# Altium schematic sheet 0263_GPU VCCGT IMVP8 VR.SchDoc
size 848 x 558 mm
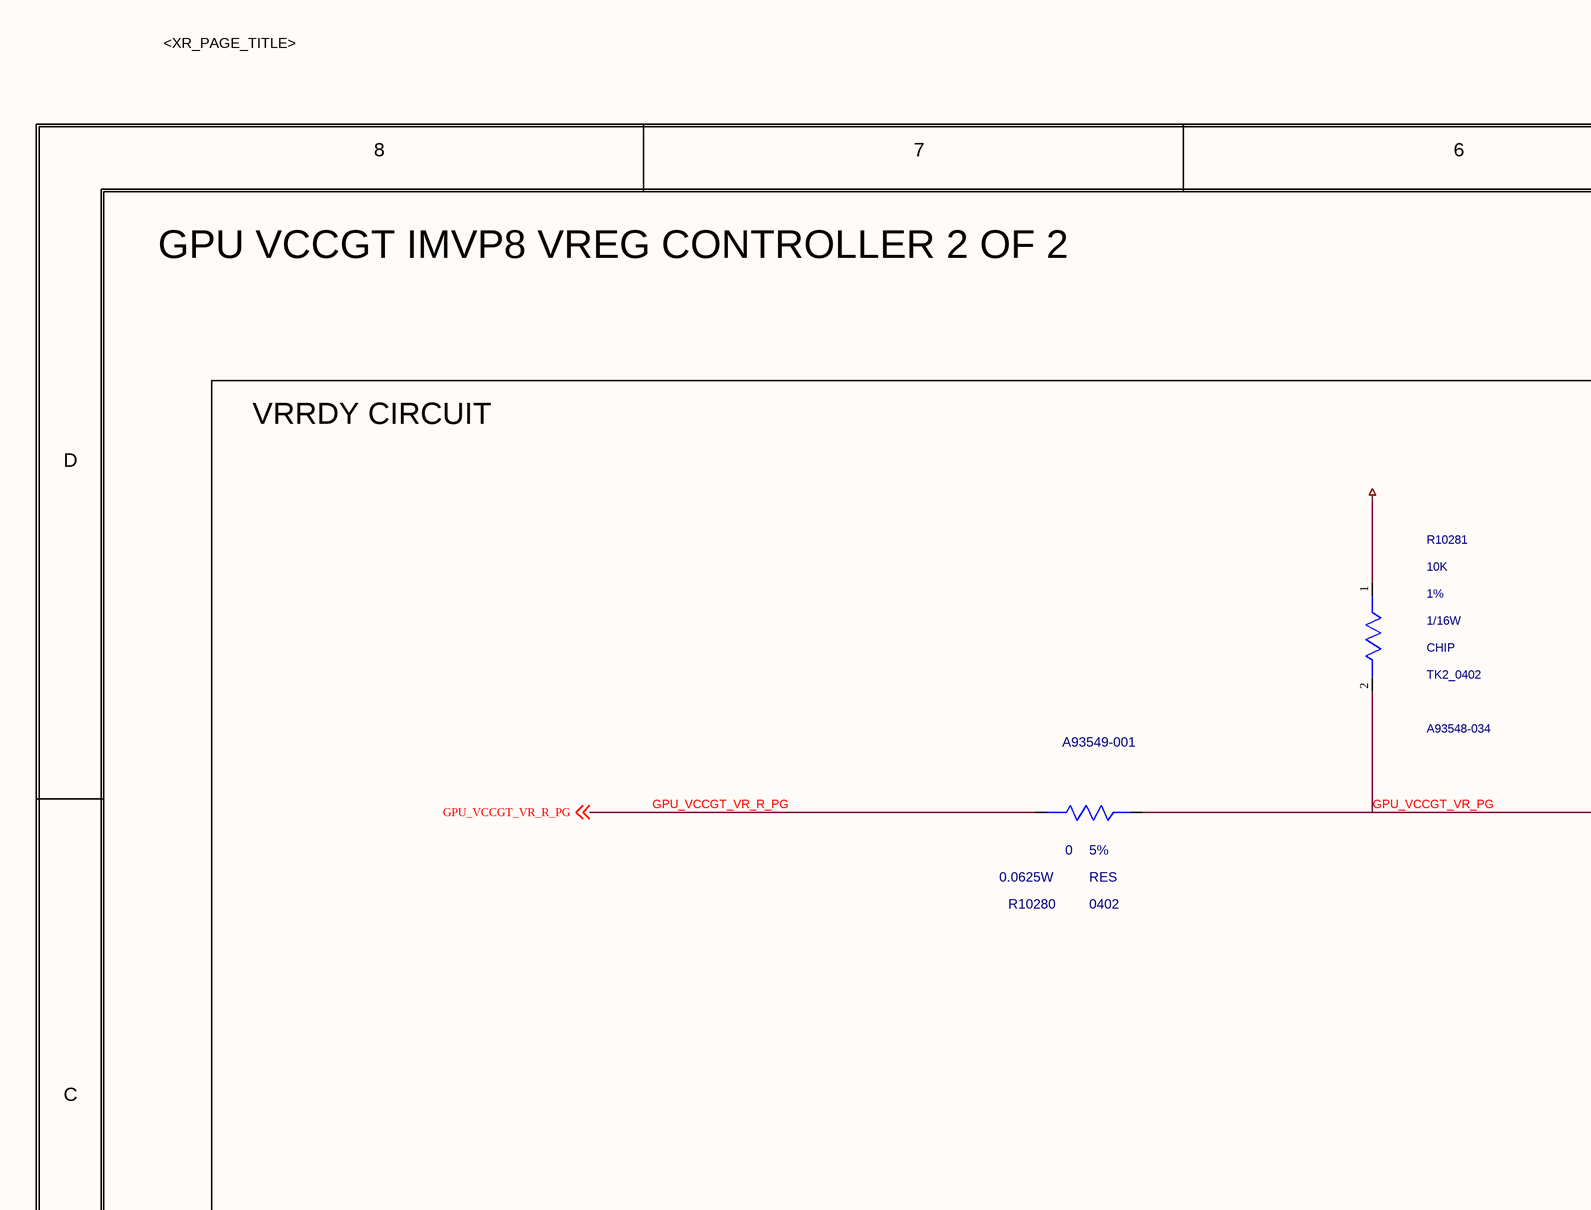
[diagram p0: 0263_GPU VCCGT IMVP8 VR.SchDoc, top left]
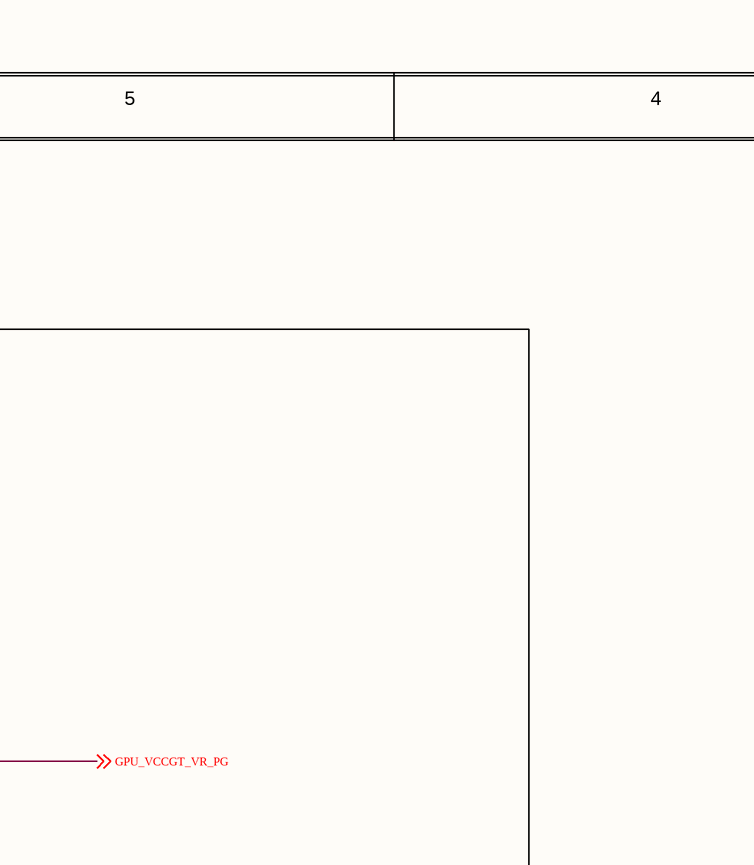
[diagram p1: 0263_GPU VCCGT IMVP8 VR.SchDoc, top middle]
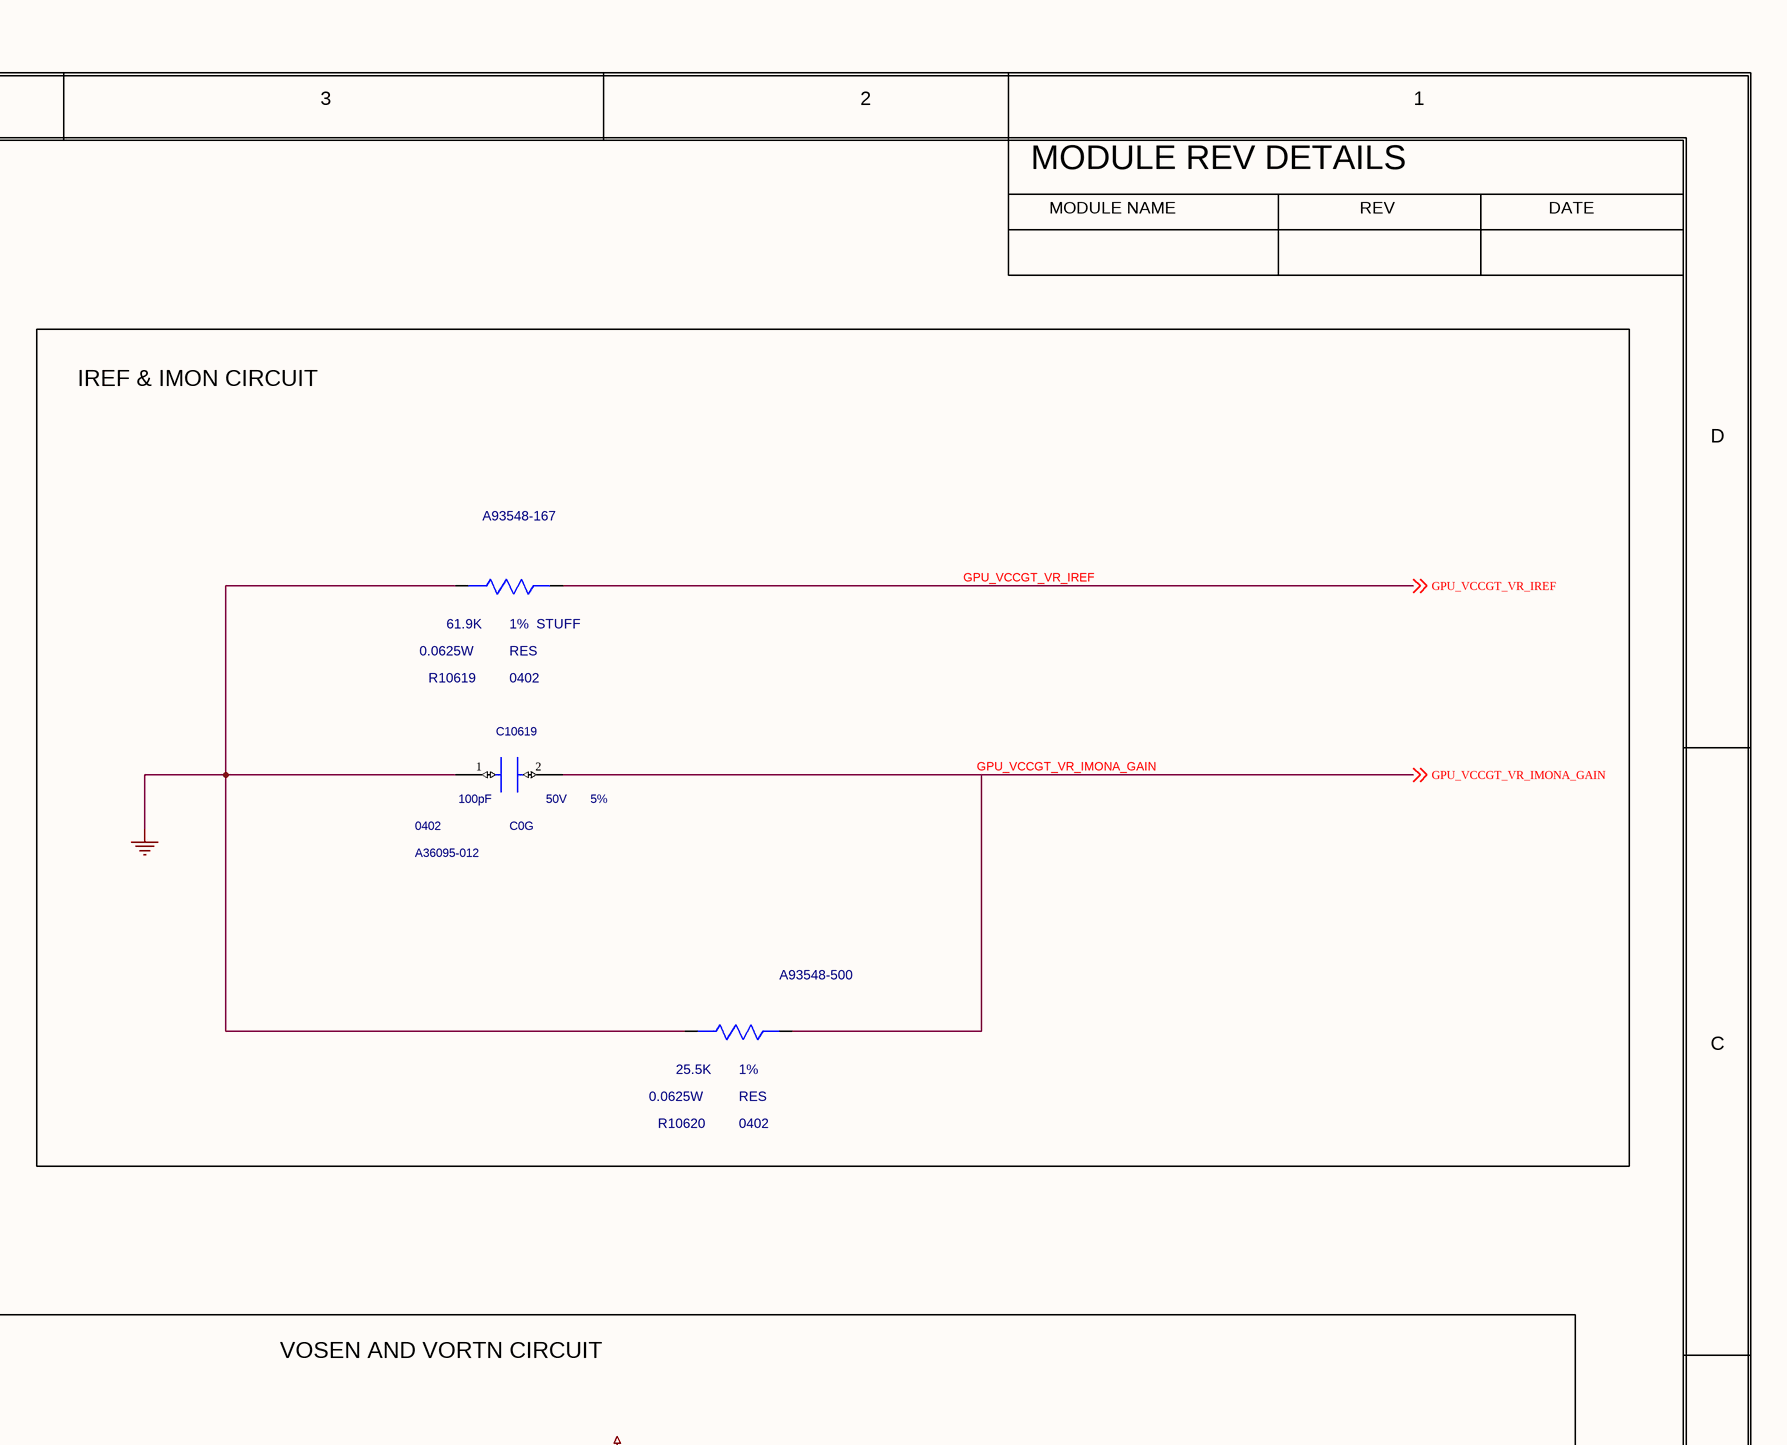
[diagram p2: 0263_GPU VCCGT IMVP8 VR.SchDoc, top right]
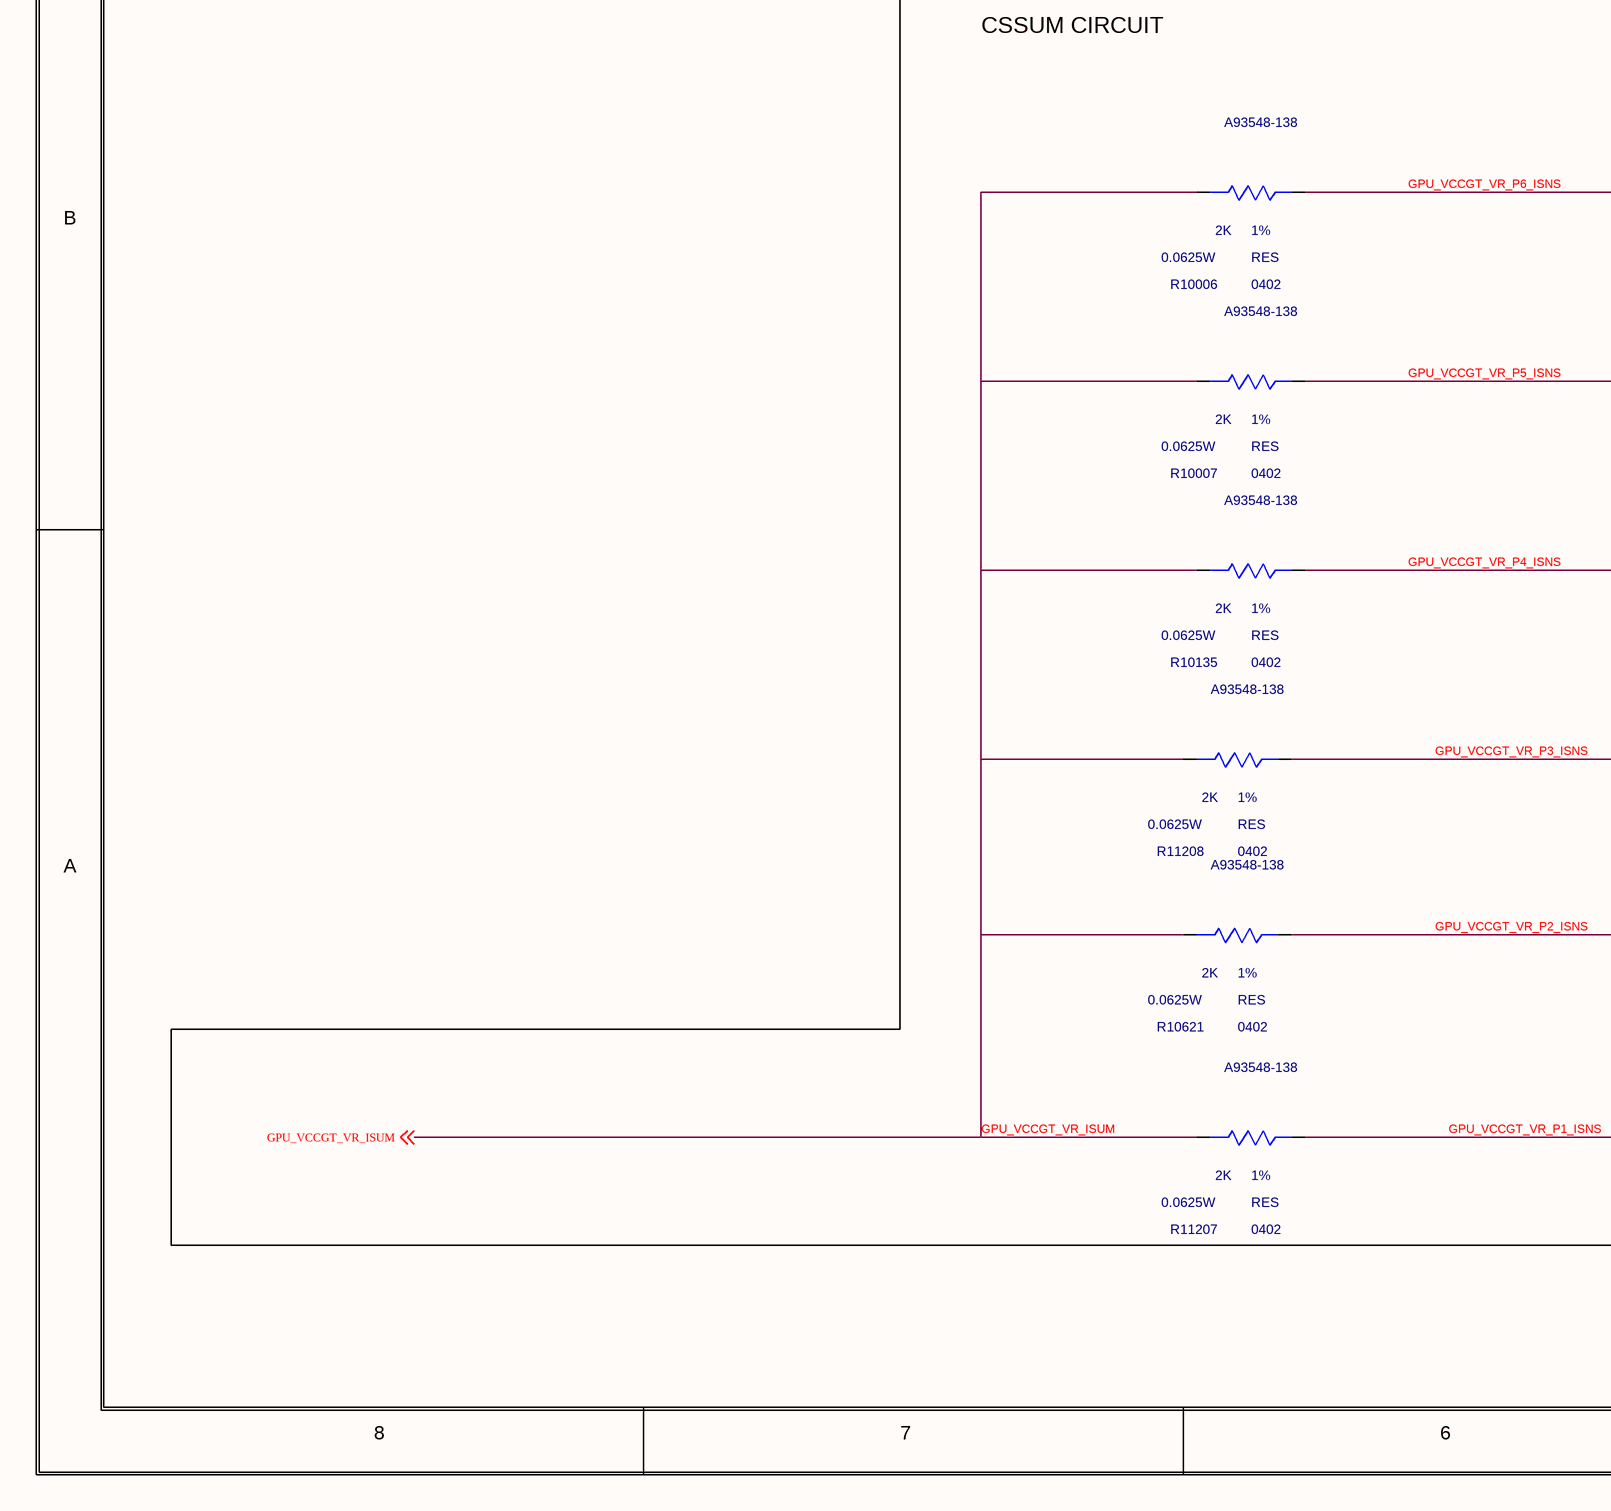
[diagram p3: 0263_GPU VCCGT IMVP8 VR.SchDoc, bottom left]
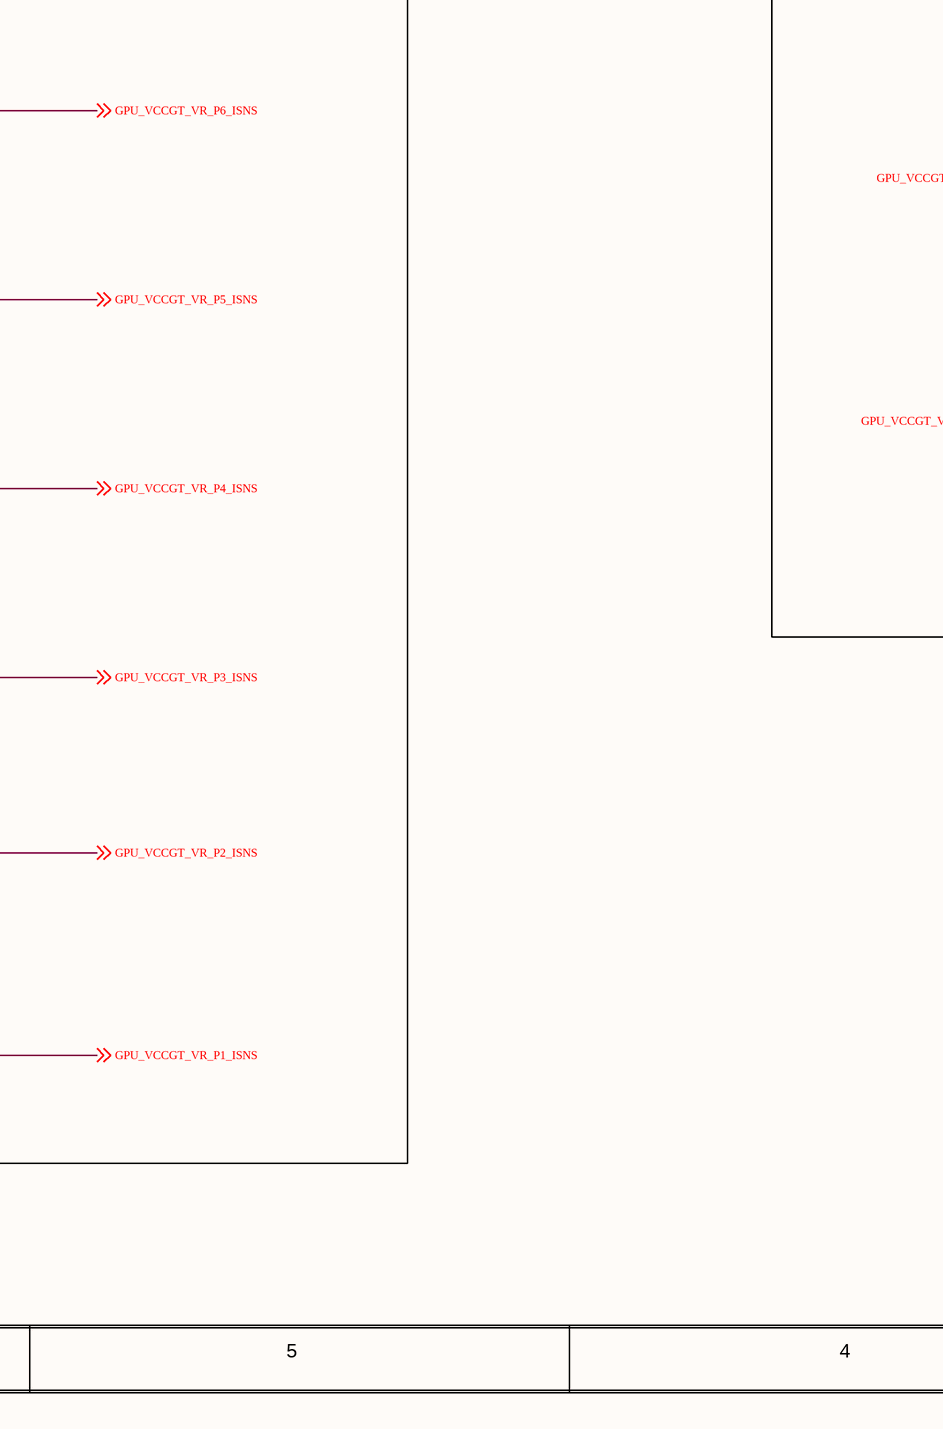
[diagram p4: 0263_GPU VCCGT IMVP8 VR.SchDoc, bottom middle]
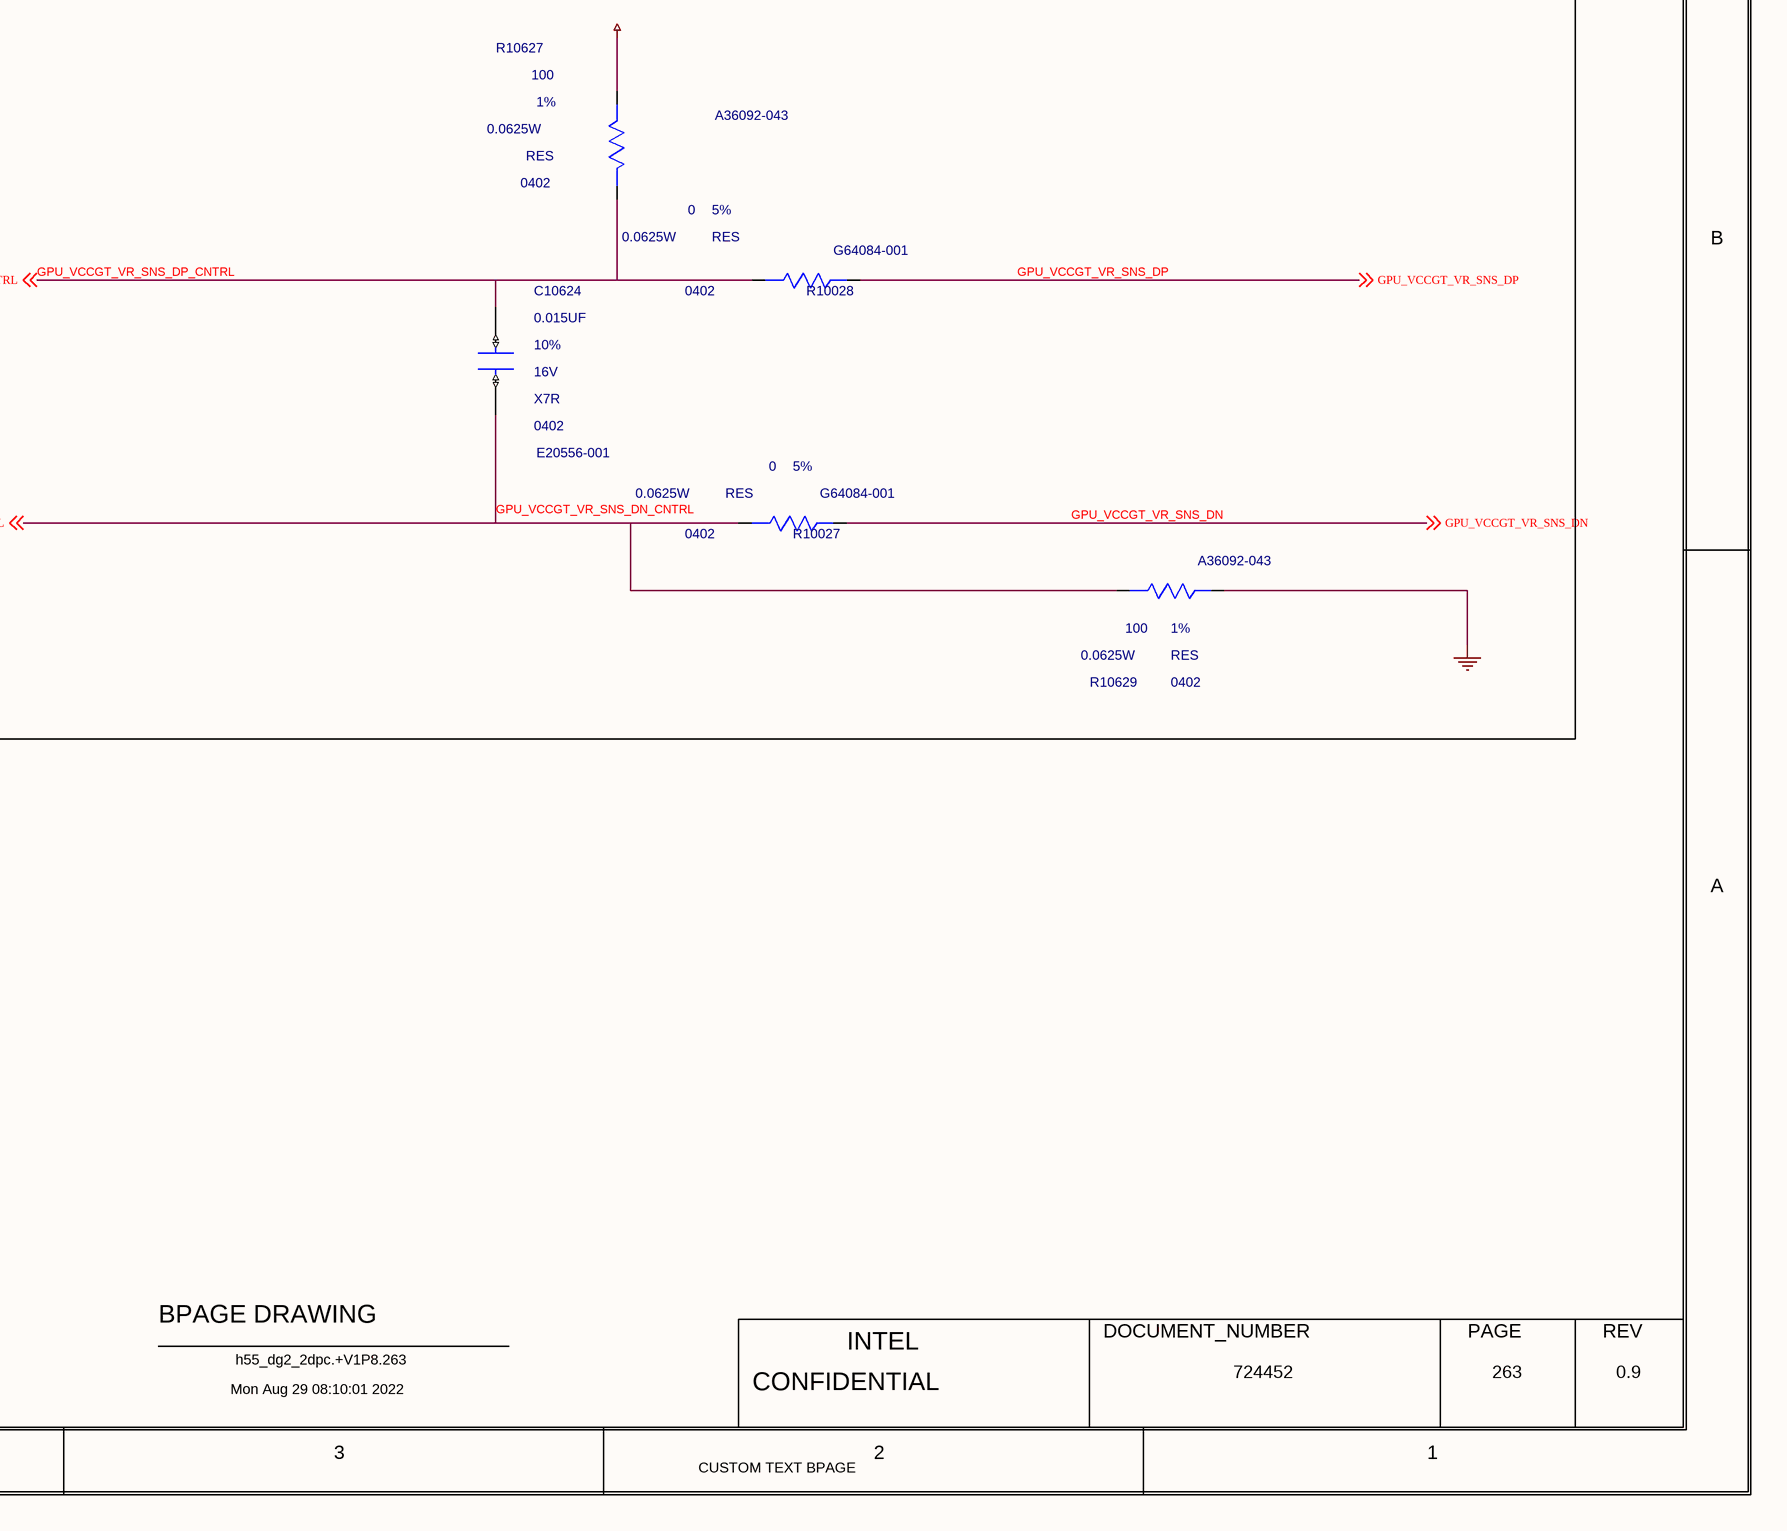
[diagram p5: 0263_GPU VCCGT IMVP8 VR.SchDoc, bottom right]

## Parts
C10619  100pF  MATERIAL: C0G  PACK_TYPE: 0402  PART_NUMBER: A36095-012  TOLERANCE: 5%  VOLTAGE: 50V  [SMC0402IA]
C10624  0.015UF  MATERIAL: X7R  PACK_TYPE: 0402  PART_NUMBER: E20556-001  TOLERANCE: 10%  VOLTAGE: 16V  [CTK2_SM0402_1050X550_MA]
R10006  2K  MATERIAL: RES  PACK_TYPE: 0402  PART_NUMBER: A93548-138  TOLERANCE: 1%  WATTAGE: 0.0625W  [CTK2_SM0402_1100X550_MA]
R10007  2K  MATERIAL: RES  PACK_TYPE: 0402  PART_NUMBER: A93548-138  TOLERANCE: 1%  WATTAGE: 0.0625W  [CTK2_SM0402_1100X550_MA]
R10027  0  MATERIAL: RES  PACK_TYPE: 0402  PART_NUMBER: G64084-001  TOLERANCE: 5%  WATTAGE: 0.0625W  [CTK2_SM0402_1100X550_MA]
R10028  0  MATERIAL: RES  PACK_TYPE: 0402  PART_NUMBER: G64084-001  TOLERANCE: 5%  WATTAGE: 0.0625W  [CTK2_SM0402_1100X550_MA]
R10135  2K  MATERIAL: RES  PACK_TYPE: 0402  PART_NUMBER: A93548-138  TOLERANCE: 1%  WATTAGE: 0.0625W  [CTK2_SM0402_1100X550_MA]
R10280  0  MATERIAL: RES  PACK_TYPE: 0402  PART_NUMBER: A93549-001  TOLERANCE: 5%  WATTAGE: 0.0625W  [CTK2_SM0402_1100X550_MA]
R10281  10K  MATERIAL: CHIP  PACK_TYPE: TK2_0402  PART_NUMBER: A93548-034  TOLERANCE: 1%  WATTAGE: 1/16W  [SMR1005MB]
R10619  61.9K  BOM_USE: STUFF  MATERIAL: RES  PACK_TYPE: 0402  PART_NUMBER: A93548-167  TOLERANCE: 1%  WATTAGE: 0.0625W  [TK2_SM0402_1100X550_MA]
R10620  25.5K  MATERIAL: RES  PACK_TYPE: 0402  PART_NUMBER: A93548-500  TOLERANCE: 1%  WATTAGE: 0.0625W  [CTK2_SM0402_1100X550_MA]
R10621  2K  MATERIAL: RES  PACK_TYPE: 0402  PART_NUMBER: A93548-138  TOLERANCE: 1%  WATTAGE: 0.0625W  [CTK2_SM0402_1100X550_MA]
R10627  100  MATERIAL: RES  PACK_TYPE: 0402  PART_NUMBER: A36092-043  TOLERANCE: 1%  WATTAGE: 0.0625W  [CTK2_SM0402_1050X550_MA]
R10629  100  MATERIAL: RES  PACK_TYPE: 0402  PART_NUMBER: A36092-043  TOLERANCE: 1%  WATTAGE: 0.0625W  [CTK2_SM0402_1050X550_MA]
R11207  2K  MATERIAL: RES  PACK_TYPE: 0402  PART_NUMBER: A93548-138  TOLERANCE: 1%  WATTAGE: 0.0625W  [CTK2_SM0402_1100X550_MA]
R11208  2K  MATERIAL: RES  PACK_TYPE: 0402  PART_NUMBER: A93548-138  TOLERANCE: 1%  WATTAGE: 0.0625W  [CTK2_SM0402_1100X550_MA]

## Blocks framed on the sheet
VRRDY CIRCUIT: R10280 R10281
IREF & IMON CIRCUIT: C10619 R10619 R10620
VOSEN AND VORTN CIRCUIT: C10624 R10027 R10028 R10627 R10629
CSSUM CIRCUIT: R10006 R10007 R10135 R10621 R11207 R11208

## Nets
+V1P8S_GPU: R10281.1(A)
+VCCGT_GPU: R10627.1(A)
GND: C10619.1(A) R10619.1(A) R10620.1(A) R10629.2(B)
GPU_VCCGT_VR_IMONA_GAIN: C10619.2(B) R10620.2(B) ; off-sheet GPU_VCCGT_VR_IMONA_GAIN
GPU_VCCGT_VR_IREF: R10619.2(B) ; off-sheet GPU_VCCGT_VR_IREF
GPU_VCCGT_VR_ISUM: R10006.1(A) R10007.1(A) R10135.1(A) R10621.1(A) R11207.1(A) R11208.1(A) ; off-sheet GPU_VCCGT_VR_ISUM
GPU_VCCGT_VR_P1_ISNS: R11207.2(B) ; off-sheet GPU_VCCGT_VR_P1_ISNS
GPU_VCCGT_VR_P2_ISNS: R10621.2(B) ; off-sheet GPU_VCCGT_VR_P2_ISNS
GPU_VCCGT_VR_P3_ISNS: R11208.2(B) ; off-sheet GPU_VCCGT_VR_P3_ISNS
GPU_VCCGT_VR_P4_ISNS: R10135.2(B) ; off-sheet GPU_VCCGT_VR_P4_ISNS
GPU_VCCGT_VR_P5_ISNS: R10007.2(B) ; off-sheet GPU_VCCGT_VR_P5_ISNS
GPU_VCCGT_VR_P6_ISNS: R10006.2(B) ; off-sheet GPU_VCCGT_VR_P6_ISNS
GPU_VCCGT_VR_PG: R10280.2(B) R10281.2(B) ; off-sheet GPU_VCCGT_VR_PG
GPU_VCCGT_VR_R_PG: R10280.1(A) ; off-sheet GPU_VCCGT_VR_R_PG
GPU_VCCGT_VR_SNS_DN: R10027.2(B) ; off-sheet GPU_VCCGT_VR_SNS_DN
GPU_VCCGT_VR_SNS_DN_CNTRL: C10624.2(B) R10027.1(A) R10629.1(A) ; off-sheet GPU_VCCGT_VR_SNS_DN_CNTRL
GPU_VCCGT_VR_SNS_DP: R10028.2(B) ; off-sheet GPU_VCCGT_VR_SNS_DP
GPU_VCCGT_VR_SNS_DP_CNTRL: C10624.1(A) R10028.1(A) R10627.2(B) ; off-sheet GPU_VCCGT_VR_SNS_DP_CNTRL

## Notes on the sheet
- <XR_PAGE_TITLE>
- 8
- 7
- 6
- 5
- 4
- 3
- 2
- 1
- MODULE REV DETAILS
- GPU VCCGT IMVP8 VREG CONTROLLER 2 OF 2
- MODULE NAME
- REV
- DATE
- D
- C
- B
- A
- BPAGE DRAWING
- INTEL
- DOCUMENT_NUMBER
- PAGE
- Mon Aug 29 08:10:01 2022
- h55_dg2_2dpc.+V1P8.263
- CONFIDENTIAL
- 724452
- 263
- 0.9
- CUSTOM TEXT BPAGE

## Library data of the parts
C10619 = CAP#1: CHIPS_PART_NAME: CAP; CDS_PHYS_PART_NAME: CAP_0402-A36095-012,C0G,100PF,50V,5%,LPDB,GENERIC; OriginalSymbolOrigin: (-25,50); XY: (-2175,3825); VER: 2; ROT: 0; PHYS_PAGE: 263; LOCATION: C10619; DRAWING: @RVP1_ADL_SB_ADP_S_DDR5_SODIMM_2DPC_LIB.H55_DG2_2DPC(SCH_1):PAGE436; CDS_LIB: discrete; PCB Footprint: SMC0402IA; CDS_PART_NAME: CAP_0402-A36095-012,C0G,100PF,50V,5%,LPDB,GENERIC; CDS_LOCATION: C10619
C10624 = C_CAP: CDS_PHYS_PART_NAME: C_CAP_0402-E20556-001,X7R,0.015UF,16V,10%,TK2,GENERIC; CDS_LMAN_SYM_OUTLINE: -50,50,50,-50; FP_TECH: TK2; IP: GENERIC; ROOM: NONE; OriginalSymbolOrigin: (-50,25); XY: (-2200,1975); VER: 1; ROT: 0; PHYS_PAGE: 263; LOCATION: C10624; DRAWING: @RVP1_ADL_SB_ADP_S_DDR5_SODIMM_2DPC_LIB.H55_DG2_2DPC(SCH_1):PAGE436; CDS_LIB: c_discrete; VARIANT: ?; PCB Footprint: CTK2_SM0402_1050X550_MA; CHIPS_PART_NAME: C_CAP; CDS_PART_NAME: C_CAP_0402-E20556-001,X7R,0.015UF,16V,10%,TK2,GENERIC; CDS_LOCATION: C10624
R10006 = C_RES#1: CHIPS_PART_NAME: C_RES; CDS_PHYS_PART_NAME: C_RES_0402-A93548-138,RES,2K,1%,0.0625W,TK2,GENERIC; CDS_LMAN_SYM_OUTLINE: -50,50,50,-50; FP_TECH: TK2; IP: GENERIC; ROOM: NONE; OriginalSymbolOrigin: (-75,25); XY: (-5875,2250); VER: 1; ROT: 0; PHYS_PAGE: 263; LOCATION: R10006; DRAWING: @RVP1_ADL_SB_ADP_S_DDR5_SODIMM_2DPC_LIB.H55_DG2_2DPC(SCH_1):PAGE436; CDS_LIB: c_discrete; VARIANT: ?; PCB Footprint: CTK2_SM0402_1100X550_MA; CDS_PART_NAME: C_RES_0402-A93548-138,RES,2K,1%,0.0625W,TK2,GENERIC; CDS_LOCATION: R10006
R10007 = C_RES#1: CHIPS_PART_NAME: C_RES; CDS_PHYS_PART_NAME: C_RES_0402-A93548-138,RES,2K,1%,0.0625W,TK2,GENERIC; CDS_LMAN_SYM_OUTLINE: -50,50,50,-50; FP_TECH: TK2; IP: GENERIC; ROOM: NONE; OriginalSymbolOrigin: (-75,25); XY: (-5875,1900); VER: 1; ROT: 0; PHYS_PAGE: 263; LOCATION: R10007; DRAWING: @RVP1_ADL_SB_ADP_S_DDR5_SODIMM_2DPC_LIB.H55_DG2_2DPC(SCH_1):PAGE436; CDS_LIB: c_discrete; VARIANT: ?; PCB Footprint: CTK2_SM0402_1100X550_MA; CDS_PART_NAME: C_RES_0402-A93548-138,RES,2K,1%,0.0625W,TK2,GENERIC; CDS_LOCATION: R10007
R10027 = C_RES#1: CHIPS_PART_NAME: C_RES; CDS_PHYS_PART_NAME: C_RES_0402-G64084-001,RES,0,5%,0.0625W,TK2,GENERIC; CDS_LMAN_SYM_OUTLINE: -50,50,50,-50; FP_TECH: TK2; IP: GENERIC; ROOM: NONE; OriginalSymbolOrigin: (-75,25); XY: (-1650,1675); VER: 1; PHYS_PAGE: 263; LOCATION: R10027; DRAWING: @RVP1_ADL_SB_ADP_S_DDR5_SODIMM_2DPC_LIB.H55_DG2_2DPC(SCH_1):PAGE436; CDS_LIB: c_discrete; VARIANT: ?; PCB Footprint: CTK2_SM0402_1100X550_MA; ROT: 0; CDS_PART_NAME: C_RES_0402-G64084-001,RES,0,5%,0.0625W,TK2,GENERIC; CDS_LOCATION: R10027
R10028 = C_RES#1: CHIPS_PART_NAME: C_RES; CDS_PHYS_PART_NAME: C_RES_0402-G64084-001,RES,0,5%,0.0625W,TK2,GENERIC; CDS_LMAN_SYM_OUTLINE: -50,50,50,-50; FP_TECH: TK2; IP: GENERIC; ROOM: NONE; OriginalSymbolOrigin: (-75,25); XY: (-1625,2125); VER: 1; PHYS_PAGE: 263; LOCATION: R10028; DRAWING: @RVP1_ADL_SB_ADP_S_DDR5_SODIMM_2DPC_LIB.H55_DG2_2DPC(SCH_1):PAGE436; CDS_LIB: c_discrete; VARIANT: ?; PCB Footprint: CTK2_SM0402_1100X550_MA; ROT: 0; CDS_PART_NAME: C_RES_0402-G64084-001,RES,0,5%,0.0625W,TK2,GENERIC; CDS_LOCATION: R10028
R10135 = C_RES#1: CHIPS_PART_NAME: C_RES; CDS_PHYS_PART_NAME: C_RES_0402-A93548-138,RES,2K,1%,0.0625W,TK2,GENERIC; CDS_LMAN_SYM_OUTLINE: -50,50,50,-50; FP_TECH: TK2; IP: GENERIC; ROOM: NONE; OriginalSymbolOrigin: (-75,25); XY: (-5875,1550); VER: 1; ROT: 0; PHYS_PAGE: 263; LOCATION: R10135; DRAWING: @RVP1_ADL_SB_ADP_S_DDR5_SODIMM_2DPC_LIB.H55_DG2_2DPC(SCH_1):PAGE436; CDS_LIB: c_discrete; VARIANT: ?; PCB Footprint: CTK2_SM0402_1100X550_MA; CDS_PART_NAME: C_RES_0402-A93548-138,RES,2K,1%,0.0625W,TK2,GENERIC; CDS_LOCATION: R10135
R10280 = C_RES#1: CHIPS_PART_NAME: C_RES; CDS_PHYS_PART_NAME: C_RES_0402-A93549-001,RES,0,5%,0.0625W,TK2,GENERIC; CDS_LMAN_SYM_OUTLINE: -50,50,50,-50; FP_TECH: TK2; IP: GENERIC; ROOM: NONE; OriginalSymbolOrigin: (-75,25); XY: (-6175,3850); VER: 1; SUB_ROOM: GPU_VCCIN; PHYS_PAGE: 263; LOCATION: R10280; DRAWING: @RVP1_ADL_SB_ADP_S_DDR5_SODIMM_2DPC_LIB.H55_DG2_2DPC(SCH_1):PAGE436; CDS_LIB: c_discrete; VARIANT: ?; PCB Footprint: CTK2_SM0402_1100X550_MA; ROT: 0; CDS_PART_NAME: C_RES_0402-A93549-001,RES,0,5%,0.0625W,TK2,GENERIC; CDS_LOCATION: R10280
R10281 = RES: CDS_PHYS_PART_NAME: RES_TK2_0402-A93548-034,CHIP,10K,1%,1/16W,TK2,GENERIC; OriginalSymbolOrigin: (-25,75); XY: (-5650,4175); VER: 2; ROT: 0; PHYS_PAGE: 263; LOCATION: R10281; IP: GENERIC; FP_TECH: TK2; DRAWING: @RVP1_ADL_SB_ADP_S_DDR5_SODIMM_2DPC_LIB.H55_DG2_2DPC(SCH_1):PAGE436; CDS_LIB: discrete; PCB Footprint: SMR1005MB; CHIPS_PART_NAME: RES; CDS_PART_NAME: RES_TK2_0402-A93548-034,CHIP,10K,1%,1/16W,TK2,GENERIC; CDS_LOCATION: R10281
R10619 = RES_2#1: CHIPS_PART_NAME: RES_2; CDS_PHYS_PART_NAME: RES_2_0402-A93548-167,RES,61.9K,1%,0.0625W,TK2,GENERIC; CDS_LMAN_SYM_OUTLINE: -50,50,50,-50; FP_TECH: TK2; IP: GENERIC; ROOM: NONE; OriginalSymbolOrigin: (-75,25); XY: (-2175,4175); VER: 1; ROT: 0; PHYS_PAGE: 263; LOCATION: R10619; DRAWING: @RVP1_ADL_SB_ADP_S_DDR5_SODIMM_2DPC_LIB.H55_DG2_2DPC(SCH_1):PAGE436; CDS_LIB: discrete_2; VARIANT: ?; PCB Footprint: TK2_SM0402_1100X550_MA; CDS_PART_NAME: RES_2_0402-A93548-167,RES,61.9K,1%,0.0625W,TK2,GENERIC; CDS_LOCATION: R10619
R10620 = C_RES#1: CHIPS_PART_NAME: C_RES; CDS_PHYS_PART_NAME: C_RES_0402-A93548-500,RES,25.5K,1%,0.0625W,TK2,GENERIC; CDS_LMAN_SYM_OUTLINE: -50,50,50,-50; FP_TECH: TK2; IP: GENERIC; ROOM: NONE; OriginalSymbolOrigin: (-75,25); XY: (-1750,3350); VER: 1; ROT: 0; PHYS_PAGE: 263; LOCATION: R10620; DRAWING: @RVP1_ADL_SB_ADP_S_DDR5_SODIMM_2DPC_LIB.H55_DG2_2DPC(SCH_1):PAGE436; CDS_LIB: c_discrete; VARIANT: ?; PCB Footprint: CTK2_SM0402_1100X550_MA; CDS_PART_NAME: C_RES_0402-A93548-500,RES,25.5K,1%,0.0625W,TK2,GENERIC; CDS_LOCATION: R10620
R10621 = C_RES#1: CHIPS_PART_NAME: C_RES; CDS_PHYS_PART_NAME: C_RES_0402-A93548-138,RES,2K,1%,0.0625W,TK2,GENERIC; CDS_LMAN_SYM_OUTLINE: -50,50,50,-50; FP_TECH: TK2; IP: GENERIC; ROOM: NONE; OriginalSymbolOrigin: (-75,25); XY: (-5900,875); VER: 1; SUB_ROOM: GPU_VCCIN; ROT: 0; PHYS_PAGE: 263; LOCATION: R10621; DRAWING: @RVP1_ADL_SB_ADP_S_DDR5_SODIMM_2DPC_LIB.H55_DG2_2DPC(SCH_1):PAGE436; CDS_LIB: c_discrete; VARIANT: ?; PCB Footprint: CTK2_SM0402_1100X550_MA; CDS_PART_NAME: C_RES_0402-A93548-138,RES,2K,1%,0.0625W,TK2,GENERIC; CDS_LOCATION: R10621
R10627 = C_RES: CDS_PHYS_PART_NAME: C_RES_0402-A36092-043,RES,100,1%,0.0625W,TK2,GENERIC; CDS_LMAN_SYM_OUTLINE: -50,50,50,-50; FP_TECH: TK2; IP: GENERIC; ROOM: NONE; OriginalSymbolOrigin: (-25,75); XY: (-1975,2375); VER: 2; SUB_ROOM: GPU_VCCIN; PHYS_PAGE: 263; LOCATION: R10627; DRAWING: @RVP1_ADL_SB_ADP_S_DDR5_SODIMM_2DPC_LIB.H55_DG2_2DPC(SCH_1):PAGE436; CDS_LIB: c_discrete; VARIANT: ?; PCB Footprint: CTK2_SM0402_1050X550_MA; ROT: 2; CHIPS_PART_NAME: C_RES; CDS_PART_NAME: C_RES_0402-A36092-043,RES,100,1%,0.0625W,TK2,GENERIC; CDS_LOCATION: R10627
R10629 = C_RES#1: CHIPS_PART_NAME: C_RES; CDS_PHYS_PART_NAME: C_RES_0402-A36092-043,RES,100,1%,0.0625W,TK2,GENERIC; CDS_LMAN_SYM_OUTLINE: -50,50,50,-50; FP_TECH: TK2; IP: GENERIC; ROOM: NONE; OriginalSymbolOrigin: (-75,25); XY: (-950,1550); VER: 1; SUB_ROOM: GPU_VCCIN; ROT: 0; PHYS_PAGE: 263; LOCATION: R10629; DRAWING: @RVP1_ADL_SB_ADP_S_DDR5_SODIMM_2DPC_LIB.H55_DG2_2DPC(SCH_1):PAGE436; CDS_LIB: c_discrete; VARIANT: ?; PCB Footprint: CTK2_SM0402_1050X550_MA; CDS_PART_NAME: C_RES_0402-A36092-043,RES,100,1%,0.0625W,TK2,GENERIC; CDS_LOCATION: R10629
R11207 = C_RES#1: CHIPS_PART_NAME: C_RES; CDS_PHYS_PART_NAME: C_RES_0402-A93548-138,RES,2K,1%,0.0625W,TK2,GENERIC; CDS_LMAN_SYM_OUTLINE: -50,50,50,-50; FP_TECH: TK2; IP: GENERIC; ROOM: NONE; OriginalSymbolOrigin: (-75,25); XY: (-5875,500); VER: 1; SUB_ROOM: GPU_VCCIN; ROT: 0; PHYS_PAGE: 263; LOCATION: R11207; DRAWING: @RVP1_ADL_SB_ADP_S_DDR5_SODIMM_2DPC_LIB.H55_DG2_2DPC(SCH_1):PAGE436; CDS_LIB: c_discrete; VARIANT: ?; PCB Footprint: CTK2_SM0402_1100X550_MA; CDS_PART_NAME: C_RES_0402-A93548-138,RES,2K,1%,0.0625W,TK2,GENERIC; CDS_LOCATION: R11207
R11208 = C_RES#1: CHIPS_PART_NAME: C_RES; CDS_PHYS_PART_NAME: C_RES_0402-A93548-138,RES,2K,1%,0.0625W,TK2,GENERIC; CDS_LMAN_SYM_OUTLINE: -50,50,50,-50; FP_TECH: TK2; IP: GENERIC; ROOM: NONE; OriginalSymbolOrigin: (-75,25); XY: (-5900,1200); VER: 1; SUB_ROOM: GPU_VCCIN; ROT: 0; PHYS_PAGE: 263; LOCATION: R11208; DRAWING: @RVP1_ADL_SB_ADP_S_DDR5_SODIMM_2DPC_LIB.H55_DG2_2DPC(SCH_1):PAGE436; CDS_LIB: c_discrete; VARIANT: ?; PCB Footprint: CTK2_SM0402_1100X550_MA; CDS_PART_NAME: C_RES_0402-A93548-138,RES,2K,1%,0.0625W,TK2,GENERIC; CDS_LOCATION: R11208